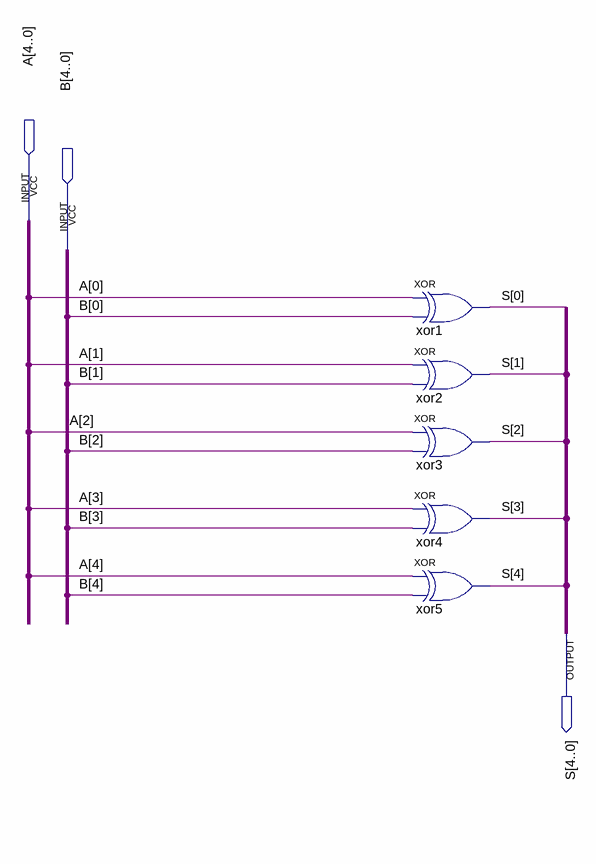
[diagram p0: schematic sheet]
// Quartus schematic XOR_completo.bdf as structural Verilog: 5 symbols, 3 pins
module XOR_completo (
  input  [4:0] A,
  input  [4:0] B,
  output [4:0] S
);

  xor xor1 (S[0], A[0], B[0]);
  xor xor2 (S[1], A[1], B[1]);
  xor xor3 (S[2], A[2], B[2]);
  xor xor4 (S[3], A[3], B[3]);
  xor xor5 (S[4], A[4], B[4]);
endmodule
